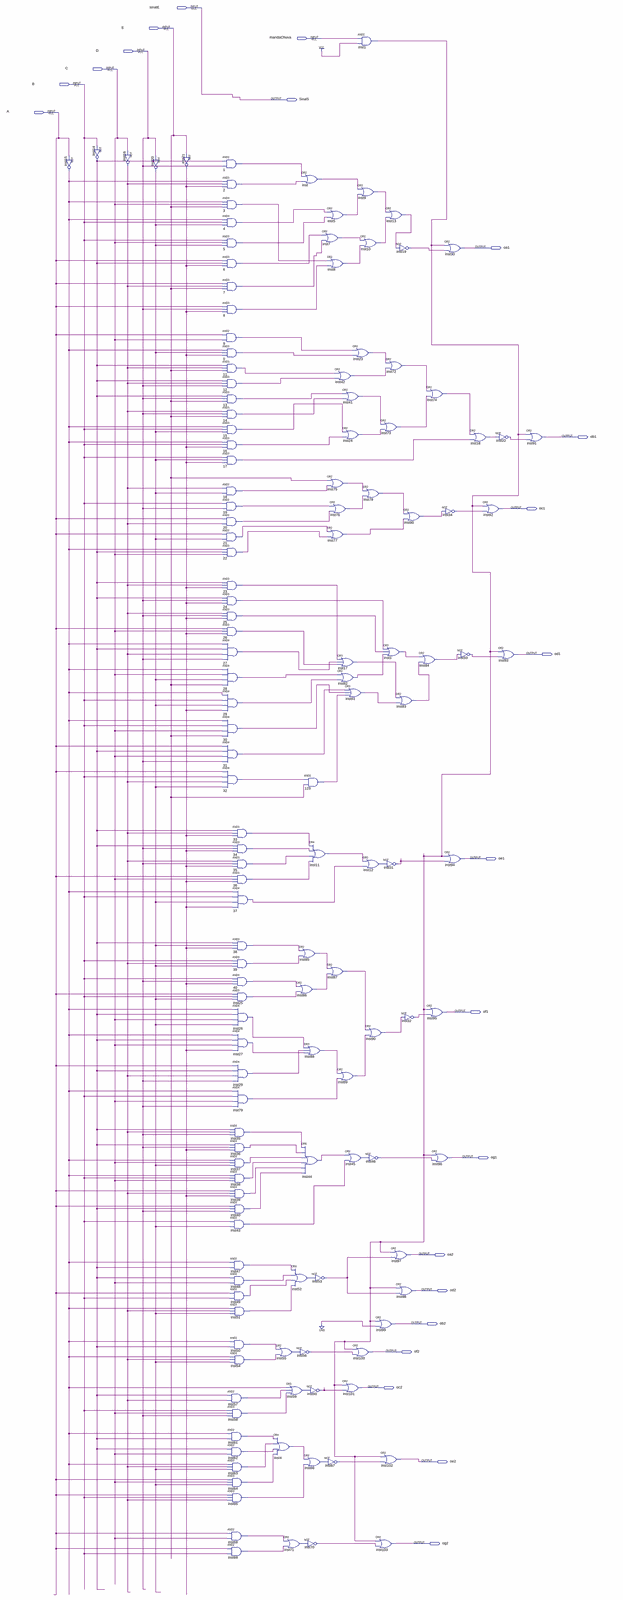
[diagram p0: schematic sheet, whole]
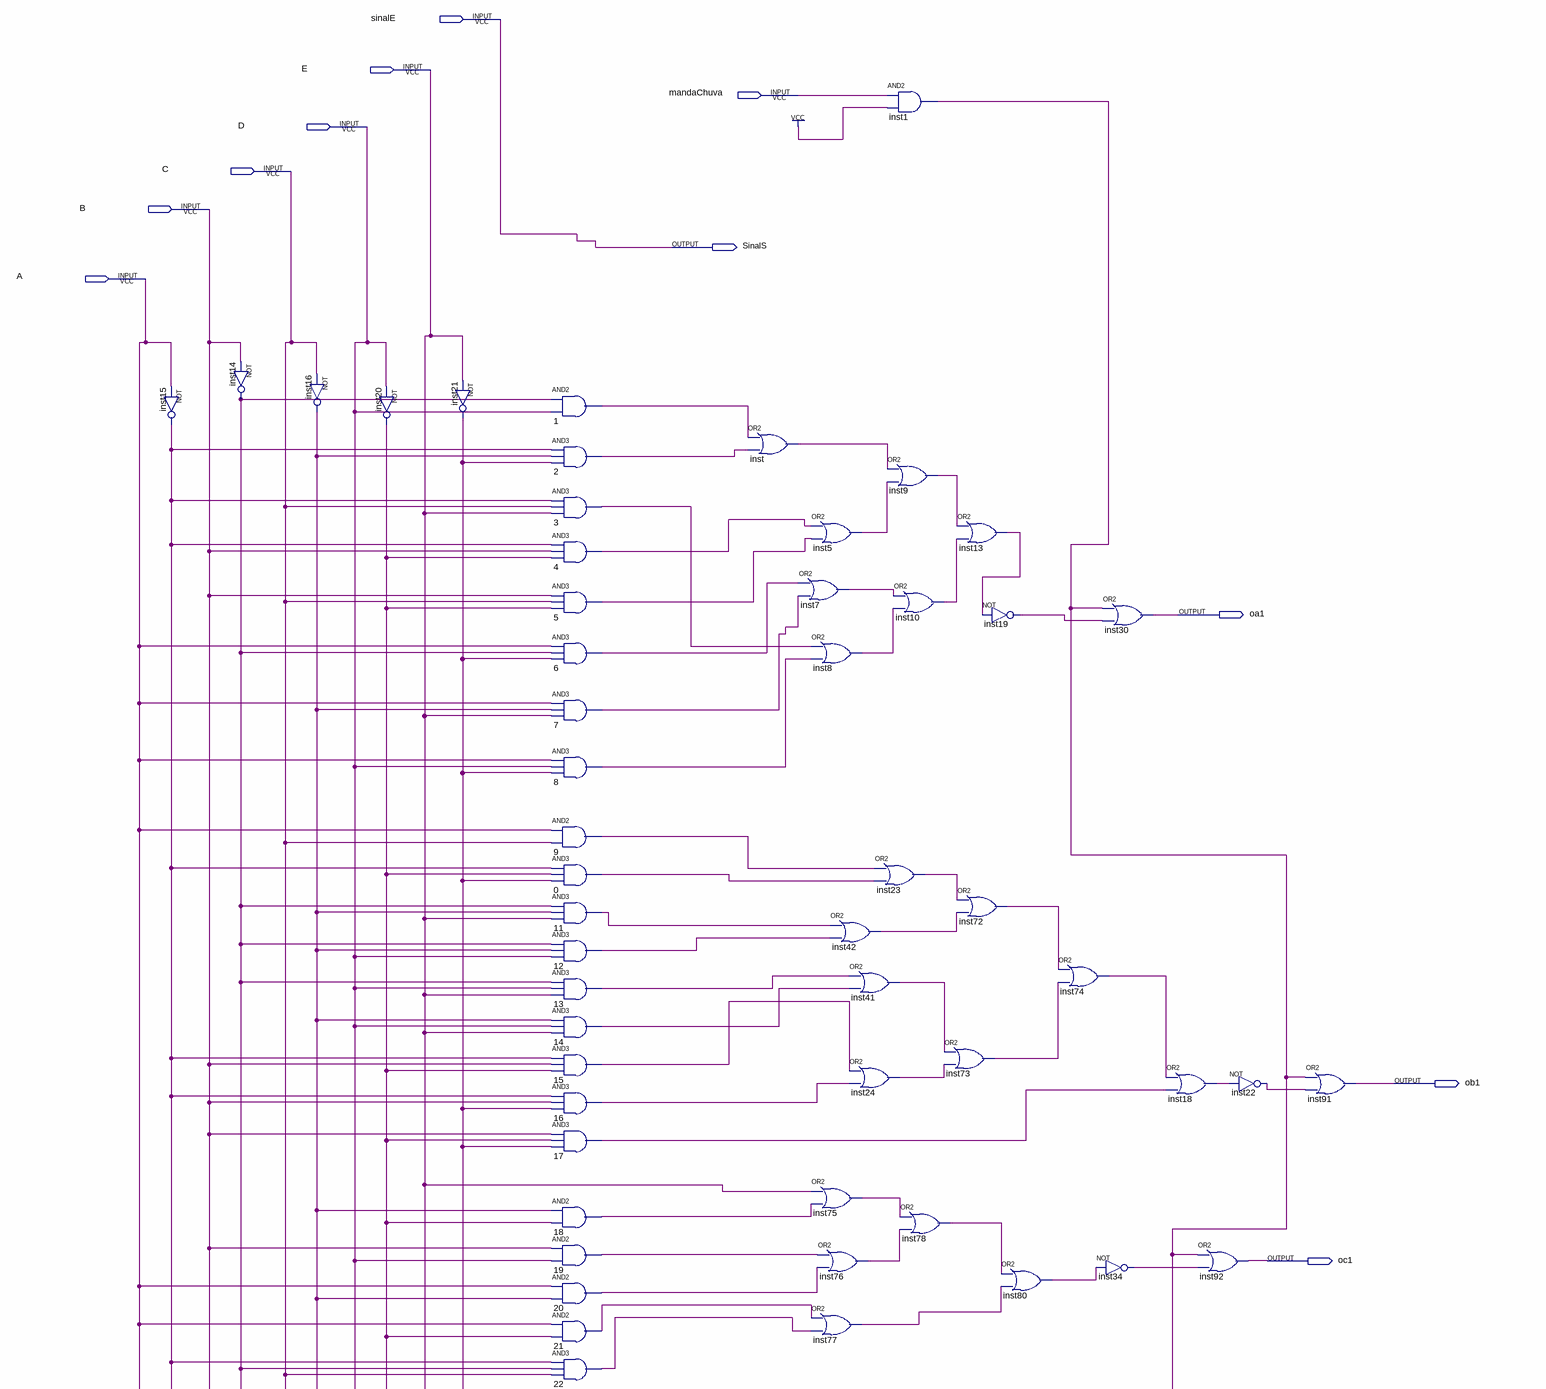
[diagram p1: schematic sheet, upper part]
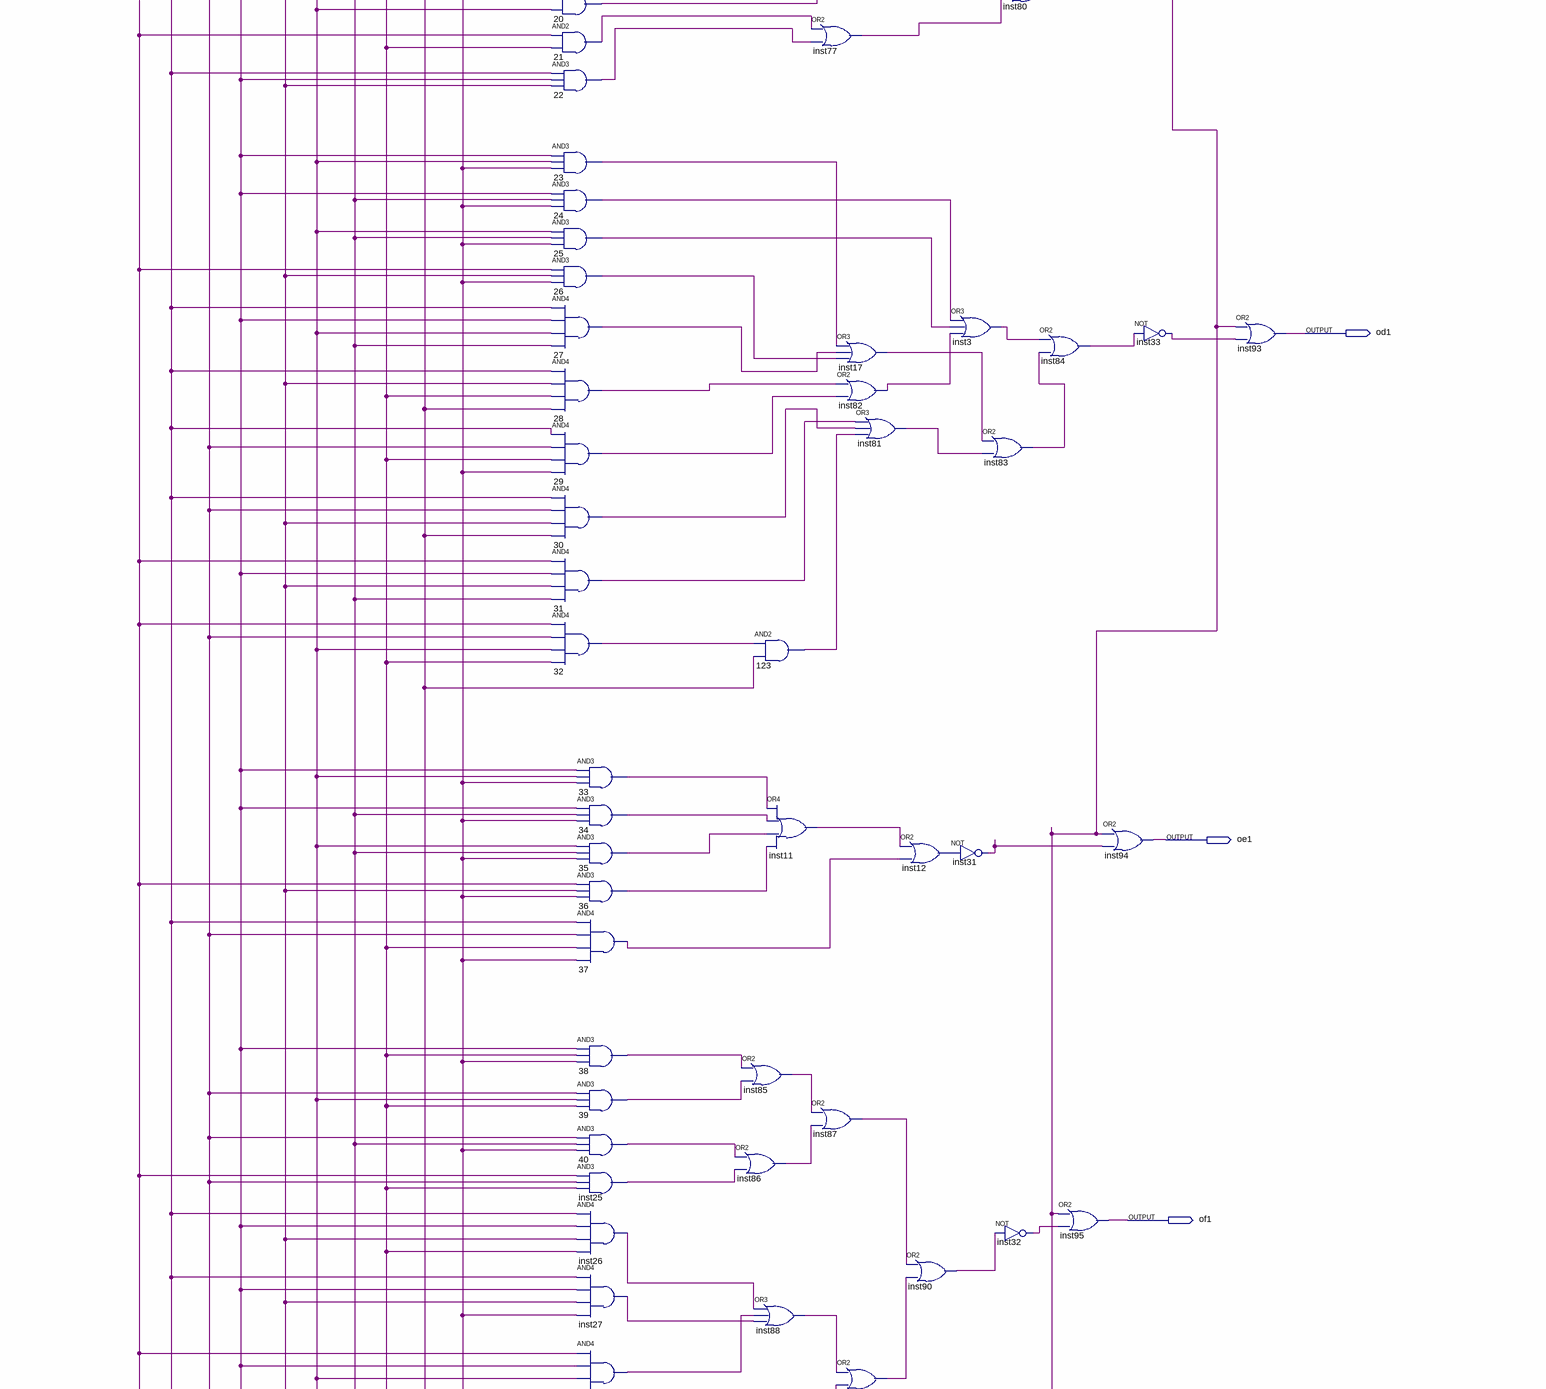
[diagram p2: schematic sheet, middle part]
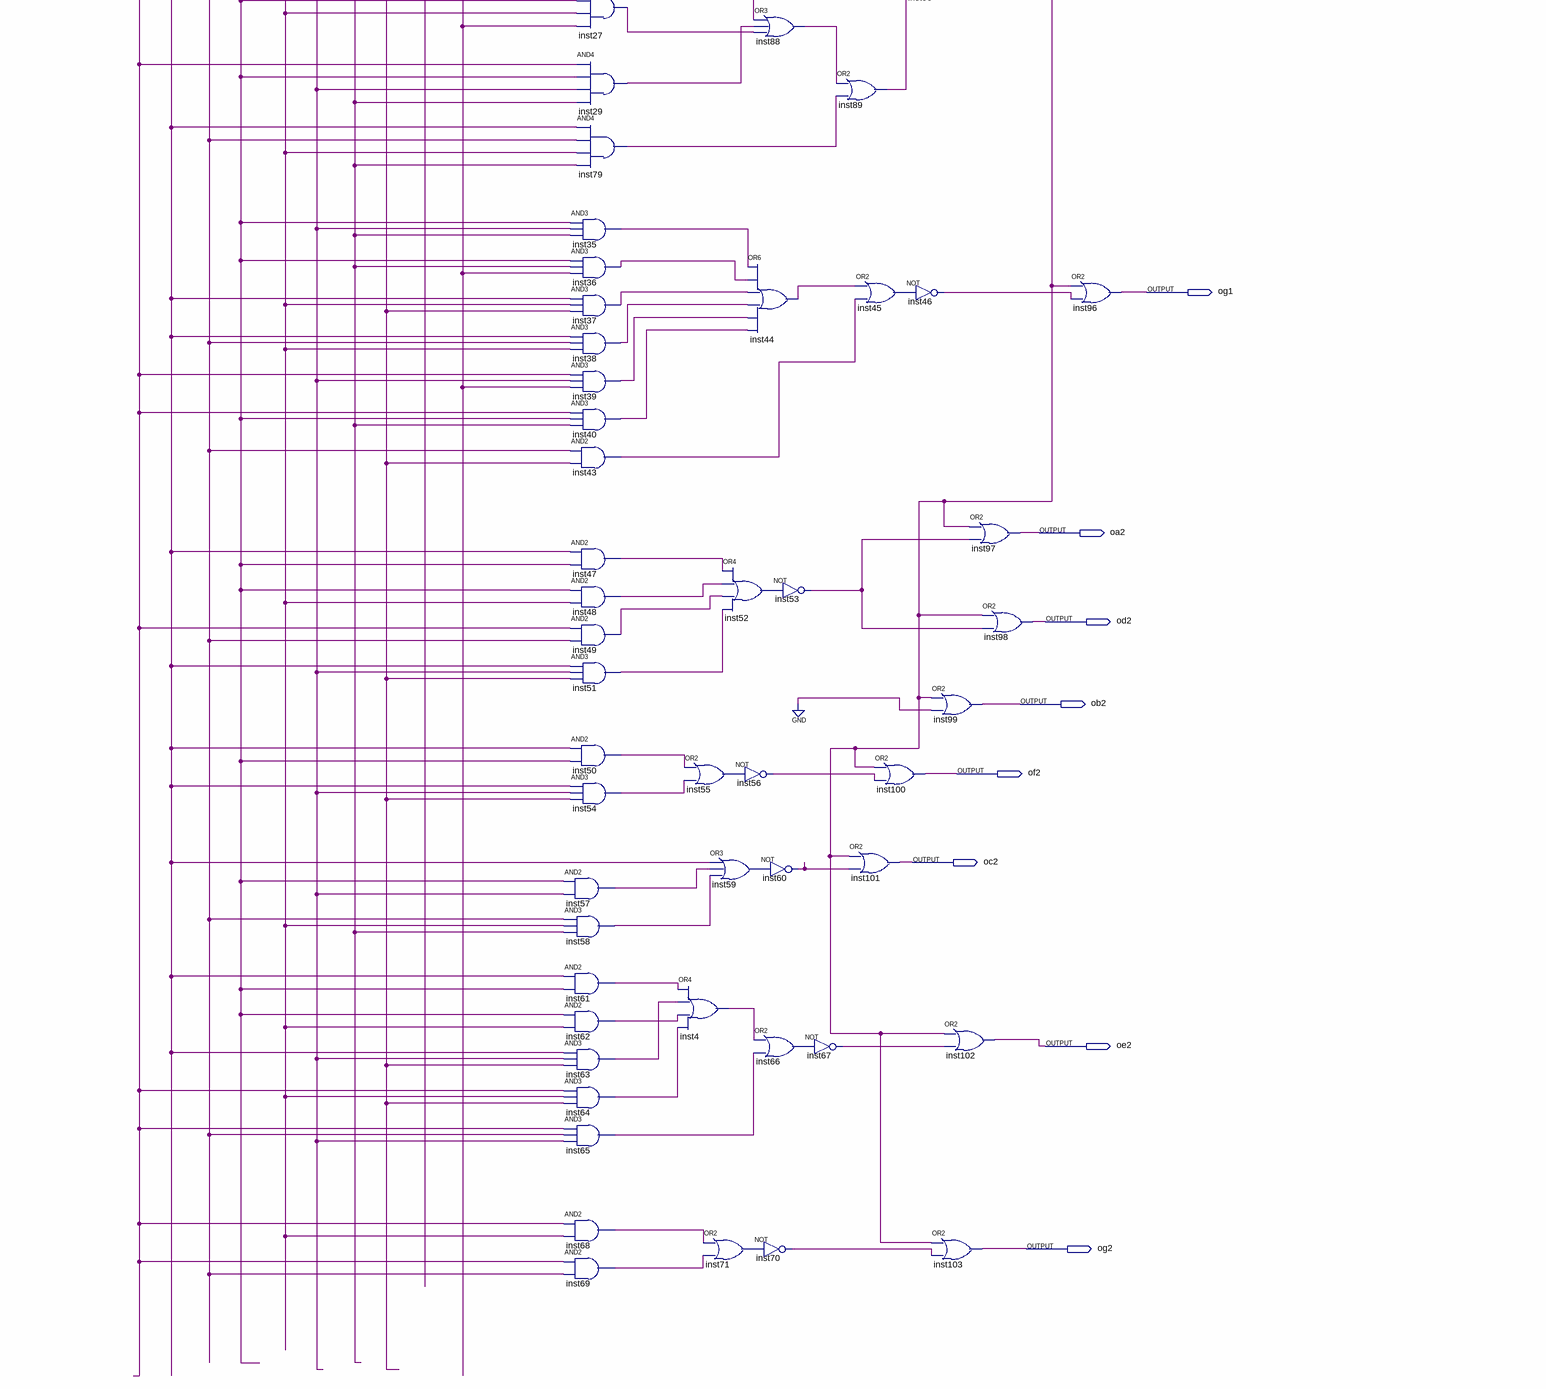
[diagram p3: schematic sheet, lower part]
// Quartus schematic bcd14segout3.bdf as structural Verilog: 142 symbols, 22 pins
module bcd14segout3 (
  input  sinalE,
  input  E,
  input  mandaChuva,
  input  D,
  input  C,
  input  B,
  input  A,
  output SinalS,
  output oa1,
  output ob1,
  output oc1,
  output od1,
  output oe1,
  output of1,
  output og1,
  output oa2,
  output od2,
  output ob2,
  output of2,
  output oc2,
  output oe2,
  output og2
);

  wire inst1_out, inst3_out, inst4_out, inst5_out, inst7_out, inst8_out, inst9_out, inst10_out, inst11_out,
       inst12_out, inst13_out, inst14_out, inst15_out, inst16_out, inst17_out, inst18_out, inst19_out,
       inst20_out, inst21_out, inst22_out, inst23_out, inst24_out, inst25_out, inst26_out, inst27_out,
       inst29_out, inst31_out, inst32_out, inst33_out, inst34_out, inst35_out, inst36_out, inst37_out,
       inst38_out, inst39_out, inst40_out, inst41_out, inst42_out, inst43_out, inst44_out, inst45_out,
       inst46_out, inst47_out, inst48_out, inst49_out, inst50_out, inst51_out, inst52_out, inst53_out,
       inst54_out, inst55_out, inst56_out, inst57_out, inst58_out, inst59_out, inst60_out, inst61_out,
       inst62_out, inst63_out, inst64_out, inst65_out, inst66_out, inst67_out, inst68_out, inst69_out,
       inst70_out, inst71_out, inst72_out, inst73_out, inst74_out, inst75_out, inst76_out, inst77_out,
       inst78_out, inst79_out, inst80_out, inst81_out, inst82_out, inst83_out, inst84_out, inst85_out,
       inst86_out, inst87_out, inst88_out, inst89_out, inst90_out, inst_out, n0_out, n1_out, n2_out, n3_out,
       n4_out, n5_out, n6_out, n7_out, n8_out, n9_out, n11_out, n12_out, n13_out, n14_out, n15_out, n16_out,
       n17_out, n18_out, n19_out, n20_out, n21_out, n22_out, n23_out, n24_out, n25_out, n26_out, n27_out,
       n28_out, n29_out, n30_out, n31_out, n32_out, n33_out, n34_out, n35_out, n36_out, n37_out, n38_out,
       n39_out, n40_out, n123_out;

  not inst15 (inst15_out, A);
  not inst14 (inst14_out, B);
  not inst16 (inst16_out, C);
  not inst20 (inst20_out, D);
  not inst21 (inst21_out, E);
  and u_1 (n1_out, inst14_out, D);
  and u_2 (n2_out, inst15_out, inst16_out, inst21_out);
  and u_3 (n3_out, inst15_out, C, E);
  and u_4 (n4_out, inst15_out, B, inst20_out);
  and u_5 (n5_out, B, C, inst20_out);
  and u_6 (n6_out, A, inst14_out, inst21_out);
  and u_7 (n7_out, A, inst16_out, E);
  and u_8 (n8_out, A, D, inst21_out);
  and u_9 (n9_out, A, C);
  and u_0 (n0_out, inst15_out, inst20_out, inst21_out);
  and u_11 (n11_out, inst14_out, inst16_out, E);
  and u_12 (n12_out, inst14_out, inst16_out, D);
  and u_13 (n13_out, inst14_out, D, E);
  and u_14 (n14_out, inst16_out, D, E);
  and u_15 (n15_out, inst15_out, B, inst20_out);
  and u_16 (n16_out, inst15_out, B, inst21_out);
  and u_17 (n17_out, B, inst20_out, inst21_out);
  and u_18 (n18_out, inst16_out, inst20_out);
  and u_19 (n19_out, B, D);
  and u_20 (n20_out, A, inst16_out);
  and u_21 (n21_out, A, inst20_out);
  and u_22 (n22_out, inst15_out, inst14_out, C);
  and u_23 (n23_out, inst14_out, inst16_out, inst21_out);
  and u_24 (n24_out, inst14_out, D, inst21_out);
  and u_25 (n25_out, inst16_out, D, inst21_out);
  and u_26 (n26_out, A, C, inst21_out);
  and u_27 (n27_out, inst15_out, inst14_out, inst16_out, D);
  and u_28 (n28_out, inst15_out, C, inst20_out, E);
  and u_29 (n29_out, inst15_out, B, inst20_out, inst21_out);
  and u_30 (n30_out, inst15_out, B, C, E);
  and u_31 (n31_out, A, inst14_out, C, D);
  and u_32 (n32_out, A, B, inst16_out, inst20_out);
  and u_33 (n33_out, inst14_out, inst16_out, inst21_out);
  and u_34 (n34_out, inst14_out, D, inst21_out);
  and u_35 (n35_out, inst16_out, D, inst21_out);
  and u_36 (n36_out, A, C, inst21_out);
  and u_37 (n37_out, inst15_out, B, inst20_out, inst21_out);
  and u_38 (n38_out, inst14_out, inst20_out, inst21_out);
  and u_39 (n39_out, B, inst16_out, inst20_out);
  and u_40 (n40_out, B, D, inst21_out);
  and inst25 (inst25_out, A, B, inst20_out);
  and inst26 (inst26_out, inst15_out, inst14_out, C, inst20_out);
  and inst27 (inst27_out, inst15_out, inst14_out, C, inst21_out);
  and inst29 (inst29_out, A, inst14_out, inst16_out, D);
  and inst79 (inst79_out, inst15_out, B, C, D);
  and inst35 (inst35_out, inst14_out, inst16_out, D);
  and inst36 (inst36_out, inst14_out, D, inst21_out);
  and inst37 (inst37_out, inst15_out, C, inst20_out);
  and inst38 (inst38_out, inst15_out, B, C);
  and inst39 (inst39_out, A, inst16_out, inst21_out);
  and inst40 (inst40_out, A, inst14_out, D);
  and inst43 (inst43_out, B, inst20_out);
  and inst47 (inst47_out, inst15_out, inst14_out);
  and inst48 (inst48_out, inst14_out, C);
  and inst49 (inst49_out, A, B);
  and inst51 (inst51_out, inst15_out, inst16_out, inst20_out);
  and inst50 (inst50_out, inst15_out, inst14_out);
  and inst54 (inst54_out, inst15_out, inst16_out, inst20_out);
  and inst57 (inst57_out, inst14_out, inst16_out);
  and inst58 (inst58_out, B, C, D);
  and inst61 (inst61_out, inst15_out, inst14_out);
  and inst62 (inst62_out, inst14_out, C);
  and inst63 (inst63_out, inst15_out, inst16_out, inst20_out);
  and inst64 (inst64_out, A, C, inst20_out);
  and inst65 (inst65_out, A, B, inst16_out);
  and inst68 (inst68_out, A, C);
  and inst69 (inst69_out, A, B);
  or inst55 (inst55_out, inst50_out, inst54_out);
  or inst4 (inst4_out, inst61_out, inst63_out, inst62_out, inst64_out);
  or inst71 (inst71_out, inst68_out, inst69_out);
  or inst (inst_out, n1_out, n2_out);
  and u_123 (n123_out, n32_out, E);
  or inst85 (inst85_out, n38_out, n39_out);
  or inst86 (inst86_out, n40_out, inst25_out);
  or inst88 (inst88_out, inst26_out, inst29_out, inst27_out);
  or inst44 (inst44_out, inst35_out, inst36_out, inst37_out, inst38_out, inst39_out, inst40_out);
  or inst52 (inst52_out, inst47_out, inst48_out, inst49_out, inst51_out);
  not inst56 (inst56_out, inst55_out);
  or inst59 (inst59_out, inst15_out, inst57_out, inst58_out);
  or inst66 (inst66_out, inst4_out, inst65_out);
  not inst70 (inst70_out, inst71_out);
  or inst7 (inst7_out, n6_out, n7_out);
  or inst11 (inst11_out, n33_out, n34_out, n35_out, n36_out);
  not inst53 (inst53_out, inst52_out);
  not inst60 (inst60_out, inst59_out);
  not inst67 (inst67_out, inst66_out);
  or inst5 (inst5_out, n4_out, n5_out);
  or inst8 (inst8_out, n3_out, n8_out);
  or inst42 (inst42_out, n11_out, n12_out);
  or inst41 (inst41_out, n13_out, n14_out);
  or inst24 (inst24_out, n15_out, n16_out);
  or inst75 (inst75_out, E, n18_out);
  or inst76 (inst76_out, n19_out, n20_out);
  or inst77 (inst77_out, n21_out, n22_out);
  or inst17 (inst17_out, n23_out, n27_out, n26_out);
  or inst82 (inst82_out, n28_out, n29_out);
  or inst81 (inst81_out, n31_out, n30_out, n123_out);
  or inst87 (inst87_out, inst85_out, inst86_out);
  or inst89 (inst89_out, inst88_out, inst79_out);
  or inst45 (inst45_out, inst44_out, inst43_out);
  or inst101 (oc2, inst1_out, inst60_out);
  and inst1 (inst1_out, mandaChuva, 1'b1);
  or inst9 (inst9_out, inst_out, inst5_out);
  or inst10 (inst10_out, inst7_out, inst8_out);
  or inst23 (inst23_out, n9_out, n0_out);
  or inst78 (inst78_out, inst75_out, inst76_out);
  or inst12 (inst12_out, inst11_out, n37_out);
  or inst90 (inst90_out, inst87_out, inst89_out);
  not inst46 (inst46_out, inst45_out);
  or inst100 (of2, inst1_out, inst56_out);
  or inst13 (inst13_out, inst9_out, inst10_out);
  or inst72 (inst72_out, inst23_out, inst42_out);
  or inst73 (inst73_out, inst41_out, inst24_out);
  or inst3 (inst3_out, n24_out, n25_out, inst82_out);
  not inst31 (inst31_out, inst12_out);
  or inst99 (ob2, inst1_out, 1'b0);
  or inst102 (oe2, inst1_out, inst67_out);
  or inst103 (og2, inst1_out, inst70_out);
  not inst19 (inst19_out, inst13_out);
  or inst80 (inst80_out, inst78_out, inst77_out);
  or inst83 (inst83_out, inst17_out, inst81_out);
  not inst32 (inst32_out, inst90_out);
  or inst97 (oa2, inst1_out, inst53_out);
  or inst98 (od2, inst1_out, inst53_out);
  or inst74 (inst74_out, inst72_out, inst73_out);
  or inst84 (inst84_out, inst3_out, inst83_out);
  or inst95 (of1, inst1_out, inst32_out);
  or inst30 (oa1, inst1_out, inst19_out);
  not inst34 (inst34_out, inst80_out);
  or inst94 (oe1, inst1_out, inst31_out);
  or inst96 (og1, inst1_out, inst46_out);
  not inst33 (inst33_out, inst84_out);
  or inst18 (inst18_out, inst74_out, n17_out);
  or inst92 (oc1, inst1_out, inst34_out);
  not inst22 (inst22_out, inst18_out);
  or inst93 (od1, inst1_out, inst33_out);
  or inst91 (ob1, inst1_out, inst22_out);

  assign SinalS = sinalE;
endmodule
